# Altium schematic sheet mixer_30mil_1GHz.SchDoc
size A3; SheetNumber: 1; SheetTotal: 1
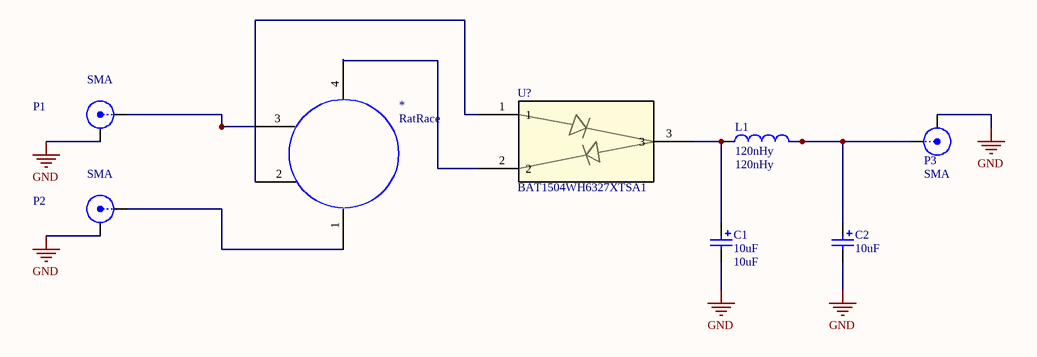
[diagram p0: mixer_30mil_1GHz.SchDoc]

## Parts
*  RatRace  [ratrace_30mil_1GHz]
C1  10uF  [6-0805_N]
C2  10uF  [6-0805_N]
L1  120nHy  [6-0805_N]
P1  SMA  [SMA-142-0701-851_V2]
P2  SMA  [SMA-142-0701-851_V2]
P3  SMA  [SMA-142-0701-851_V2]
U?  BAT1504WH6327XTSA1  [SOT_327XTSA1_INF]

## Nets
GND: C1.2 C2.2 P1.2(Y) P2.2(Y) P3.2(Y)
Net*_1: *.1 P2.1(X)
Net*_2: *.2 U?.1
Net*_3: *.3 P1.1(X)
Net*_4: *.4 U?.2
NetC1_1: C1.1 L1.1 U?.3
NetC2_1: C2.1 L1.2 P3.1(X)

## Library data of the parts
C1 C2 = Cap Pol2_1: Polarized Capacitor (Axial); Published: 8-Jun-2000; LatestRevisionDate: 17-Jul-2002; LatestRevisionNote: Re-released for DXP Platform.; PackageReference: POLAR0.8; Publisher: Altium Limited; PackageDescription: Polarized Capacitor; 2 Leads
  C1: Value: 10uF
L1 = Inductor: Code_IEC: 1005; Published: 8-Jun-2000; LatestRevisionDate: 29-May-2009; LatestRevisionNote: IPC-7351 Footprint Added.; PackageReference: 0402-A; Publisher: Altium Limited; PackageDescription: Chip Inductor; Code_JEITA: 0402; Value: 120nHy
P1-P3 = SMB: SMB Straight Connector; LatestRevisionDate: 17-Jul-2002; LatestRevisionNote: Re-released for DXP Platform.; Publisher: Altium Limited
U? = BAT1504WH6327XTSA1: No Description Available; Mfr_Name: Infineon; RefDes: RefDes; Type: Type